# Altium schematic sheet Altium_Vacuum Gauge V1.1.schdoc
size 291 x 287 mm
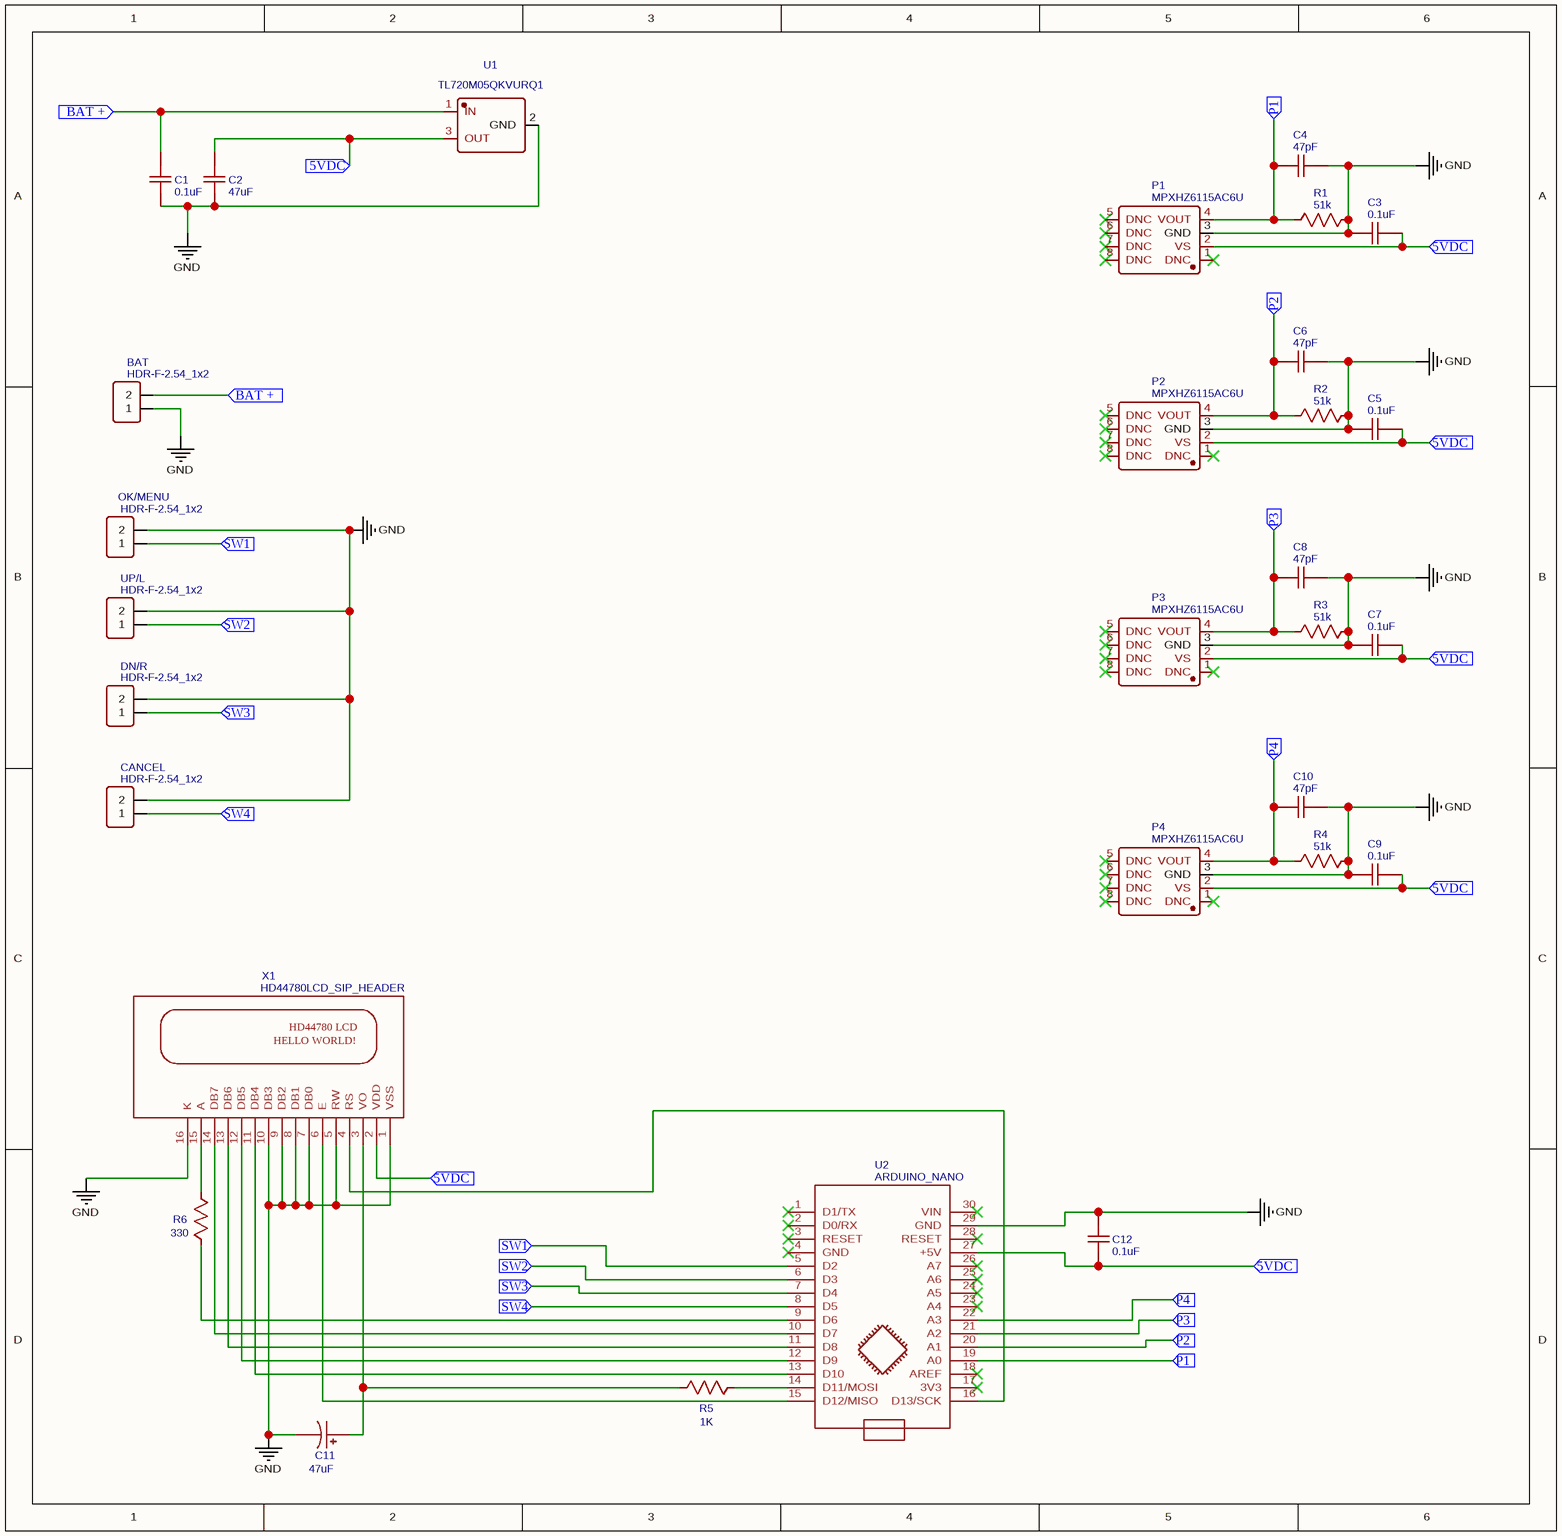
[diagram p0: Altium_Vacuum Gauge V1.1.schdoc]

## Parts
BAT  HDR-F-2.54_1x2  [HDR-F-2.54_1X2]
C1  0.1uF  [C1206]
C2  47uF  [C1206]
C3  0.1uF  [C1206]
C4  47pF  [C1206]
C5  0.1uF  [C1206]
C6  47pF  [C1206]
C7  0.1uF  [C1206]
C8  47pF  [C1206]
C9  0.1uF  [C1206]
C10  47pF  [C1206]
C11  47uF  [CASE-A_3216]
C12  0.1uF  [C1206]
CANCEL  HDR-F-2.54_1x2  [HDR-F-2.54_1X2]
DN/R  HDR-F-2.54_1x2  [HDR-F-2.54_1X2]
OK/MENU  HDR-F-2.54_1x2  [HDR-F-2.54_1X2]
P1  MPXHZ6115AC6U  [SSOP-8_L7.6-W7.6-P1.27-LS10.2-BR]
P2  MPXHZ6115AC6U  [SSOP-8_L7.6-W7.6-P1.27-LS10.2-BR]
P3  MPXHZ6115AC6U  [SSOP-8_L7.6-W7.6-P1.27-LS10.2-BR]
P4  MPXHZ6115AC6U  [SSOP-8_L7.6-W7.6-P1.27-LS10.2-BR]
R1  51k  [R1206]
R2  51k  [R1206]
R3  51k  [R1206]
R4  51k  [R1206]
R5  1K  [R1206]
R6  330  [R1206]
U1  TL720M05QKVURQ1  [TO-252-3_L6.5-W5.8-P4.58-BR]
U2  ARDUINO_NANO  [ARDUINO_NANO]
UP/L  HDR-F-2.54_1x2  [HDR-F-2.54_1X2]
X1  HD44780LCD_SIP_HEADER  [HD44780LCD_SIP_HEADER]

## Ports
5VDC (in), BAT + (in), P1 (in), P2 (in), P3 (in), P4 (in), SW1 (in), SW2 (in), SW3 (in), SW4 (in)

## Nets
GND: BAT.1 C1.1 C2.1 C3.2 C4.1 C5.2 C6.1 C7.2 C8.1 C9.2 C10.1 C11.2 C12.1 CANCEL.2 DN/R.2 OK/MENU.2 P1.3(GND) P2.3(GND) P3.3(GND) P4.3(GND) R1.2 R2.2 R3.2 R4.2 U1.2(GND) U2.29(GND) UP/L.2 X1.1(VSS) X1.5(RW) X1.7(DB0) X1.8(DB1) X1.9(DB2) X1.10(DB3) X1.16(K)
5VDC: C2.2 C3.1 C5.1 C7.1 C9.1 C12.2 P1.2(VS) P2.2(VS) P3.2(VS) P4.2(VS) U1.3(OUT) U2.27(+5V) X1.2(VDD) ; port 5VDC
BAT +: BAT.2 C1.2 U1.1(IN) ; port BAT +
P1: C4.2 P1.4(VOUT) R1.1 U2.19(A0) ; port P1
P2: C6.2 P2.4(VOUT) R2.1 U2.20(A1) ; port P2
P3: C8.2 P3.4(VOUT) R3.1 U2.21(A2) ; port P3
P4: C10.2 P4.4(VOUT) R4.1 U2.22(A3) ; port P4
SW1: OK/MENU.1 U2.5(D2) ; port SW1
SW2: U2.6(D3) UP/L.1 ; port SW2
SW3: DN/R.1 U2.7(D4) ; port SW3
SW4: CANCEL.1 U2.8(D5) ; port SW4
NetC11_1: C11.1 R5.1 X1.3(VO)
NetR5_2: R5.2 U2.14(D11/MOSI)
NetR6_1: R6.1 X1.15(A)
NetR6_2: R6.2 U2.9(D6)
NetU2_10: U2.10(D7) X1.14(DB7)
NetU2_11: U2.11(D8) X1.13(DB6)
NetU2_12: U2.12(D9) X1.12(DB5)
NetU2_13: U2.13(D10) X1.11(DB4)
NetU2_15: U2.15(D12/MISO) X1.6(E)
NetU2_16: U2.16(D13/SCK) X1.4(RS)

Not connected (* = marked no-connect by the designer): P1 1(DNC)* 5(DNC)* 6(DNC)* 7(DNC)* 8(DNC)*; P2 1(DNC)* 5(DNC)* 6(DNC)* 7(DNC)* 8(DNC)*; P3 1(DNC)* 5(DNC)* 6(DNC)* 7(DNC)* 8(DNC)*; P4 1(DNC)* 5(DNC)* 6(DNC)* 7(DNC)* 8(DNC)*; U2 1(D1/TX)* 2(D0/RX)* 3(RESET)* 4(GND)* 17(3V3)* 18(AREF)* 23(A4)* 24(A5)* 25(A6)* 26(A7)* 28(RESET)* 30(VIN)*

## Notes on the sheet
- (in symbol HD44780LCD_SIP_HEADER) HD44780 LCD; HELLO WORLD!

## Library data of the parts
BAT CANCEL DN/R OK/MENU UP/L = HDR-F-2.54_1x2: Contributor: LCEDA_Lib; BOM_Supplier Part: C49661; BOM_Supplier: LCSC; spicePre: H; spiceSymbolName: HDR-F-2.54_1x2
C1 C3 C5 C7 C9 C12 = 0.1uF: nameAlias: Value(F); Contributor: LCEDA_Lib; spicePre: C; spiceSymbolName: C_1206_US
C2 C11 = 47uF: nameAlias: Value(F); Contributor: LCEDA_Lib; spicePre: C
  C2: spiceSymbolName: C_1206_US
  C11: spiceSymbolName: C_Tan_SMD_A_US
C4 C6 C8 C10 = 47pF: nameAlias: Value(F); Contributor: LCEDA_Lib; spicePre: C; spiceSymbolName: C_1206_US
P1-P4 = MPXHZ6115AC6U: BOM_Manufacturer: NXP Semicon; BOM_Manufacturer Part: MPXHZ6400AC6T1; Contributor: LCSC; BOM_Supplier: LCSC; BOM_Supplier Part: C511770; spicePre: U; spiceSymbolName: MPXHZ6400AC6T1
R1-R4 = 51k: nameAlias: Value(Ω); Contributor: LCEDA_Lib; spicePre: R; spiceSymbolName: R_1206_US
R5 = 1K: nameAlias: Value(Ω); Contributor: LCEDA_Lib; spicePre: R; spiceSymbolName: R_1206_US
R6 = 330: nameAlias: Value(Ω); Contributor: LCEDA_Lib; spicePre: R; spiceSymbolName: R_1206_US
U1 = TL720M05QKVURQ1: BOM_Manufacturer: Texas Instruments; Contributor: LCSC; BOM_Supplier: LCSC; BOM_Supplier Part: C486028; BOM_Manufacturer Part: TL720M05QKVURQ1; spicePre: U; spiceSymbolName: TL720M05QKVURQ1
U2 = ARDUINO_NANO: sourceId: KGSeAWhDB; timeStamp: 1452340004; spicePre: U; spiceSymbolName: ARDUINO_NANO
X1 = HD44780LCD_SIP_HEADER: Contributor: krmoyle76; spicePre: X; spiceSymbolName: HD44780LCD_SIP_HEADER